# EAGLE design DancingLightBluetoothSpeakerTE_MP_Project (EAGLE 9.5.1)
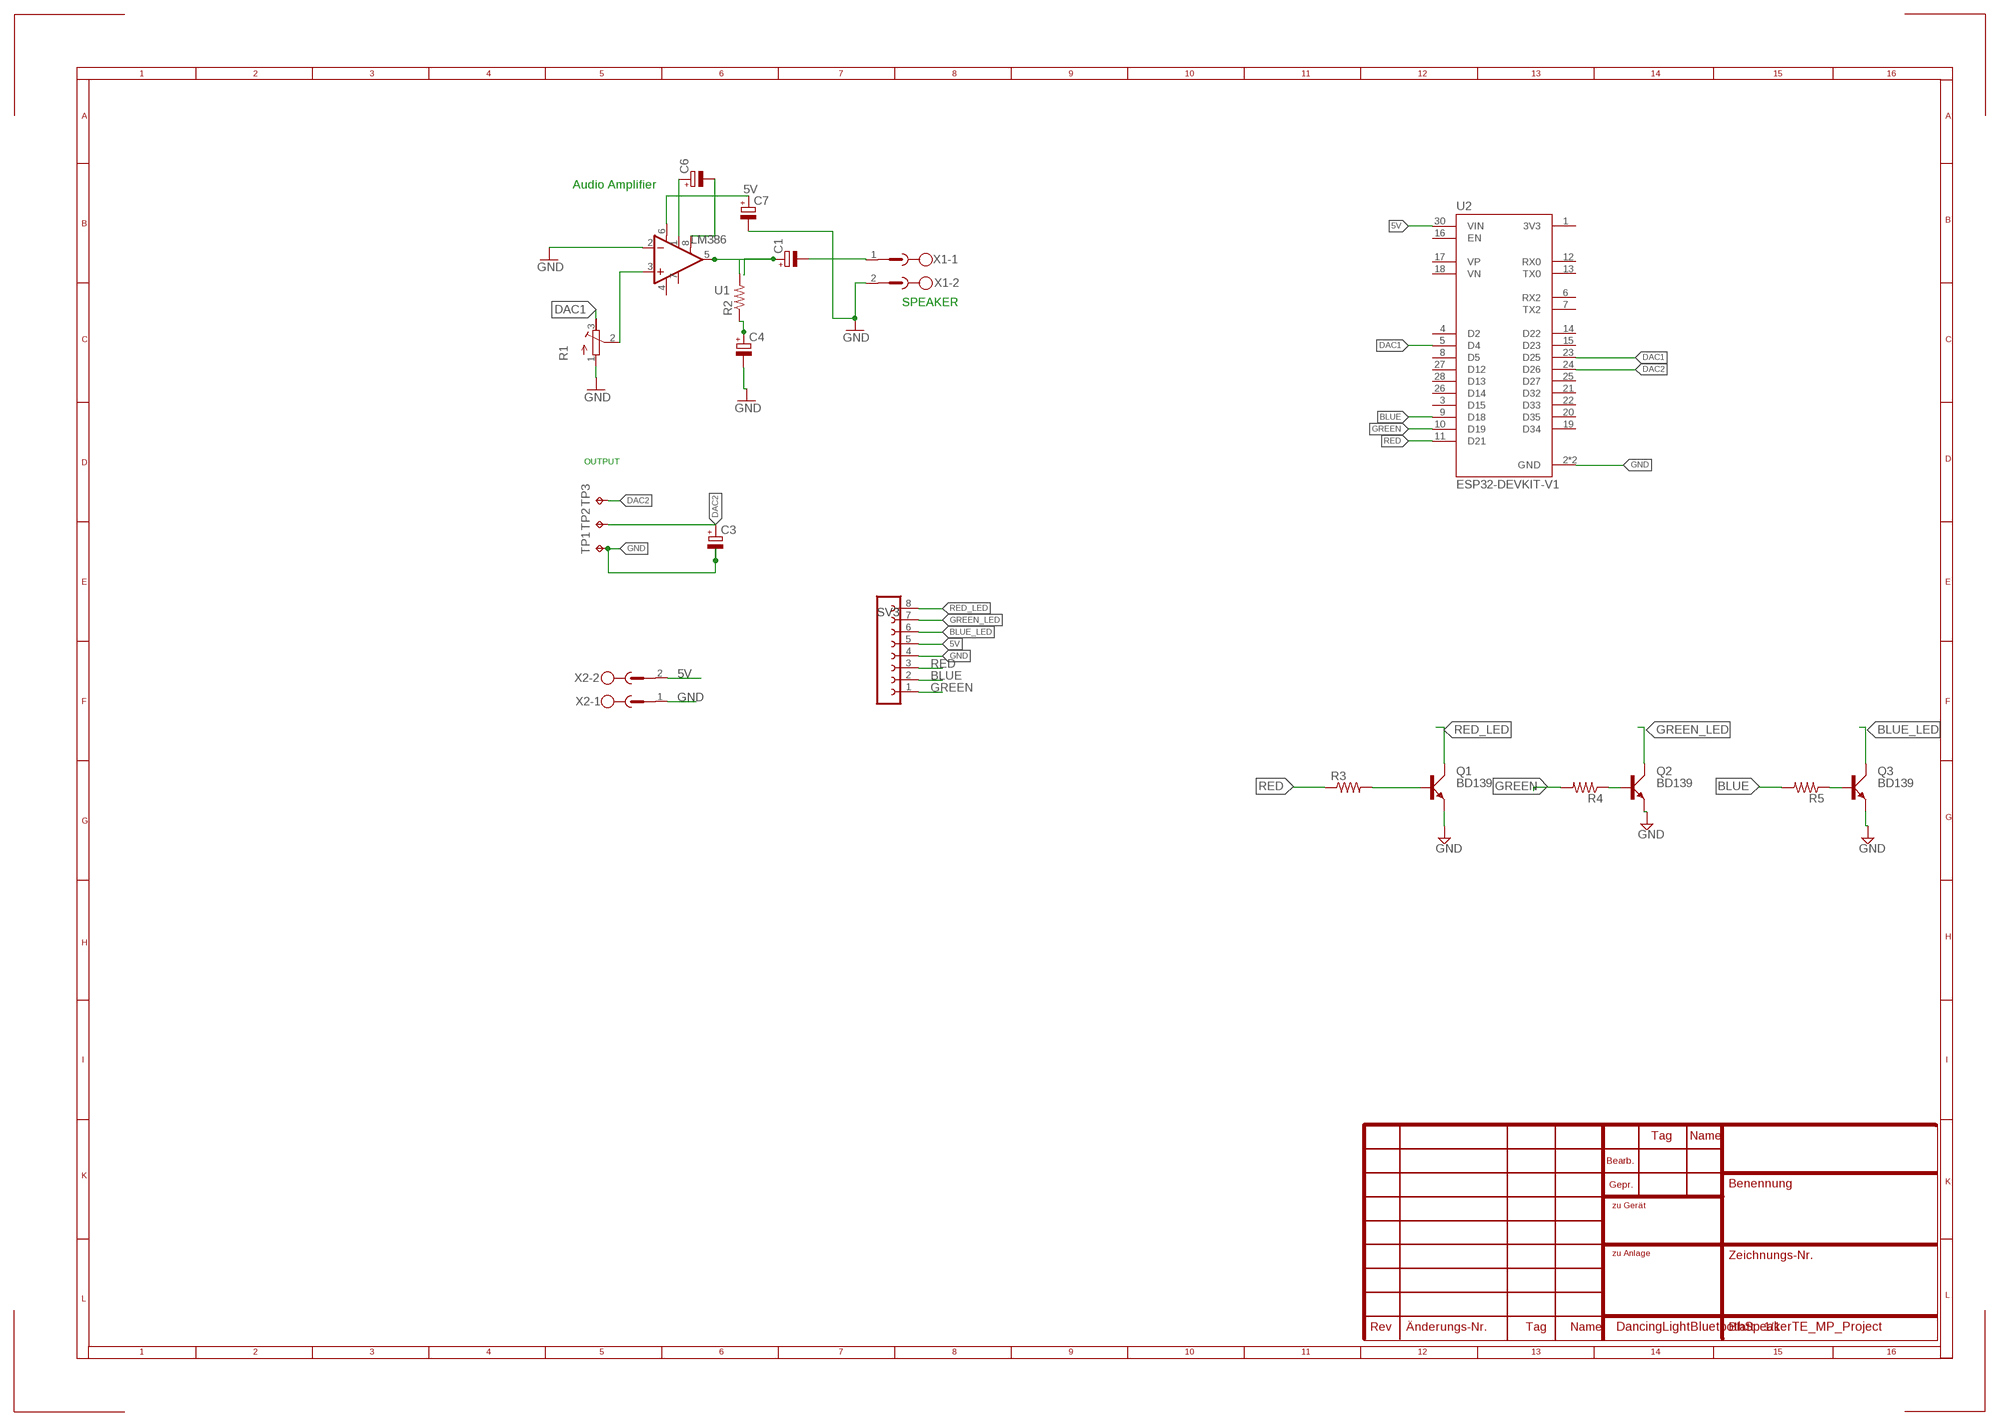
[diagram p0: schematic, sheet 1]

## Parts
C1  CPOL-EUE2-5  [E2-5]
C3  CPOL-EUE2-5  [E2-5]
C4  CPOL-EUE2-5  [E2-5]
C6  CPOL-EUE2-5  [E2-5]
C7  CPOL-EUE2-5  [E2-5]
Q1  BD139  [TO126AV]
Q2  BD139  [TO126AV]
Q3  BD139  [TO126AV]
R1  R-TRIMM3339P  [RTRIM3339P]
R2  R-US_0207/10  [0207/10]
R3  R-US_0207/10  [0207/10]
R4  R-US_0207/10  [0207/10]
R5  R-US_0207/10  [0207/10]
SV3  FE08-1  [FE08]
TP1  TPTP10SQ  [TP10SQ]
TP2  TPTP10SQ  [TP10SQ]
TP3  TPTP10SQ  [TP10SQ]
U1  LM386  [DIP08]
U2  ESP32-DEVKIT-V1  [MODULE_ESP32_DEVKIT_V1]
X1  MSTBV2  [MSTBV2]
X2  MSTBV2  [MSTBV2]

## Nets
5V: C7.+ SV3.5 U1.6(V+) U2.30(VIN) X2.2
BLUE: R5.2 SV3.2 U2.9(D18)
BLUE_LED: Q3.C SV3.6
DAC1: R1.3(E) U2.5(D4) U2.23(D25)
DAC2: C3.+ TP2.TP TP3.TP U2.24(D26)
GND: C3.- C4.- C7.- Q1.E Q2.E Q3.E R1.1(A) SV3.4 TP1.TP U1.2(-IN) U2.2(GND) U2.29(GND) X1.2 X2.1
GREEN: R4.2 SV3.1 U2.10(D19)
GREEN_LED: Q2.C SV3.7
N$1: C1.- X1.1
N$2: C4.+ R2.1
N$3: C1.+ R2.2 U1.5(OUT)
N$4: R1.2(S) U1.3(+IN)
N$5: Q1.B R3.2
N$6: Q2.B R4.1
N$7: Q3.B R5.1
N$9: C6.+ U1.1(GAIN)
N$10: C6.- U1.8(GAIN)
RED: R3.1 SV3.3 U2.11(D21)
RED_LED: Q1.C SV3.8
Unconnected: U1.7(BP) U2.1(3V3) U2.3(D15) U2.4(D2) U2.6(RX2) U2.7(TX2) U2.8(D5) U2.12(RX0) U2.13(TX0) U2.14(D22) U2.15(D23) U2.16(EN) U2.17(VP) U2.18(VN) U2.19(D34) U2.20(D35) U2.21(D32) U2.22(D33) U2.25(D27) U2.26(D14) U2.27(D12) U2.28(D13)

## Notes on the sheet
- Audio Amplifier
- SPEAKER
- OUTPUT

## Power pins joined to a net without a drawn wire
V-: U1.4(V-)

## Library data of the parts
C1 C3 C4 C6 C7 = rcl:CPOL-EU: POLARIZED CAPACITOR, European symbol; SPICEPREFIX: C
Q1-Q3 = transistor-power:BD139: NPN TRANSISTOR
R1 = rcl:R-TRIMM: Trimm resistor; SPICEMODEL: X; SPICEPREFIXL: POT
R2-R5 = adafruit:R-US_: RESISTOR, American symbol
SV3 = con-lsta:FE08-1: FEMALE HEADER; OC_FARNELL: unknown; OC_NEWARK: unknown
TP1-TP3 = testpad:TP: Test pad
U1 = LM386:LM386: low voltage audio power amplifier Check availability <https://pricing.snapeda.com/parts/LM386/Texas%20Instruments/view-part?ref=eda>; AVAILABILITY: In Stock; DESCRIPTION: Audio Amp Speaker 1-CH Mono 0.325W Class-AB 8-Pin VSSOP T/R; MF: Texas Instruments; MP: LM386; PACKAGE: DIP-8 Texas Instruments; PRICE: None; PURCHASE-URL: https://pricing.snapeda.com/search/part/LM386/?ref=eda
U2 = ESP32-DEVKIT-V1:ESP32-DEVKIT-V1: Dual core, Wi-Fi: 2.4 GHz up to 150 Mbits/s,BLE (Bluetooth Low Energy) and legacy Bluetooth, 32 bits, Up to 240 MHz Check availability <https://pricing.snapeda.com/parts/ESP32-DEVKIT-V1/Do%20it/view-part?ref=eda>; AVAILABILITY: Not in stock; DESCRIPTION: Dual core, Wi-Fi: 2.4 GHz up to 150 Mbits/s,BLE (Bluetooth Low Energy) and legacy Bluetooth, 32 bits, Up to 240 MHz; MF: Do it; MP: ESP32-DEVKIT-V1; PACKAGE: None; PRICE: None
X1 X2 = con-phoenix-500:MSTBV2: PHOENIX; OC_FARNELL: unknown; OC_NEWARK: unknown

## Board
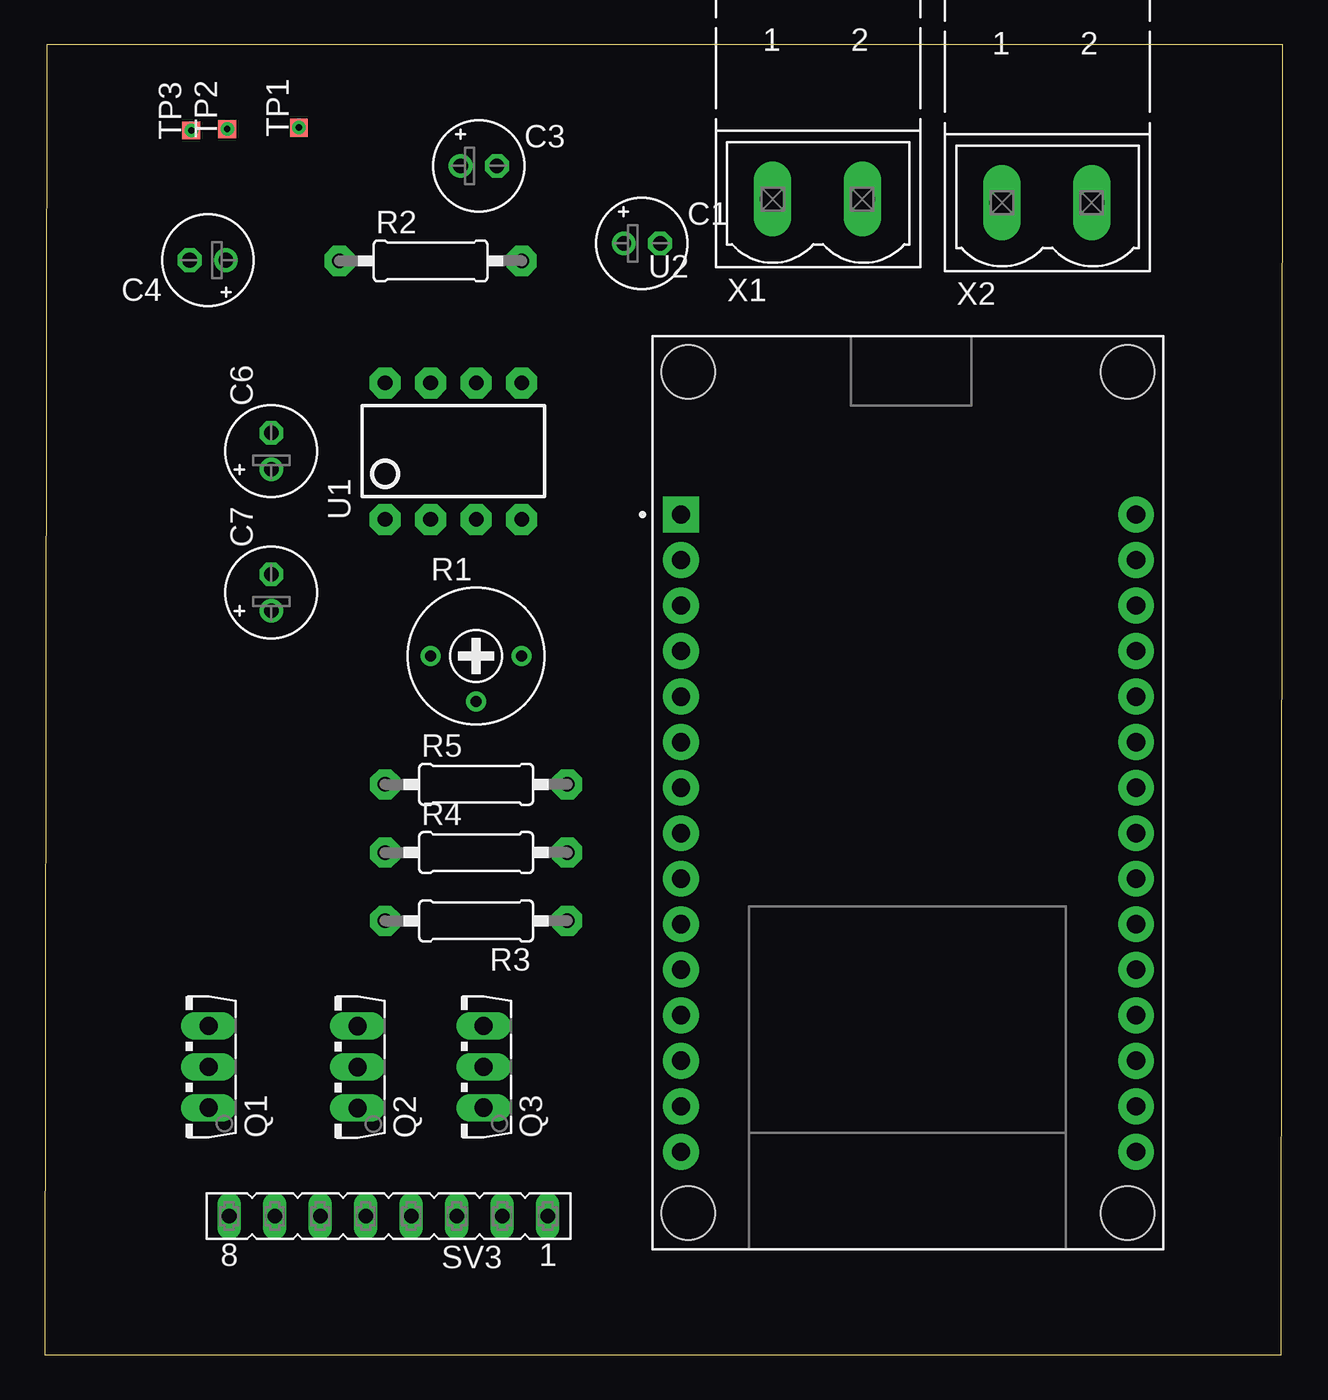
[diagram p1: board, top side]
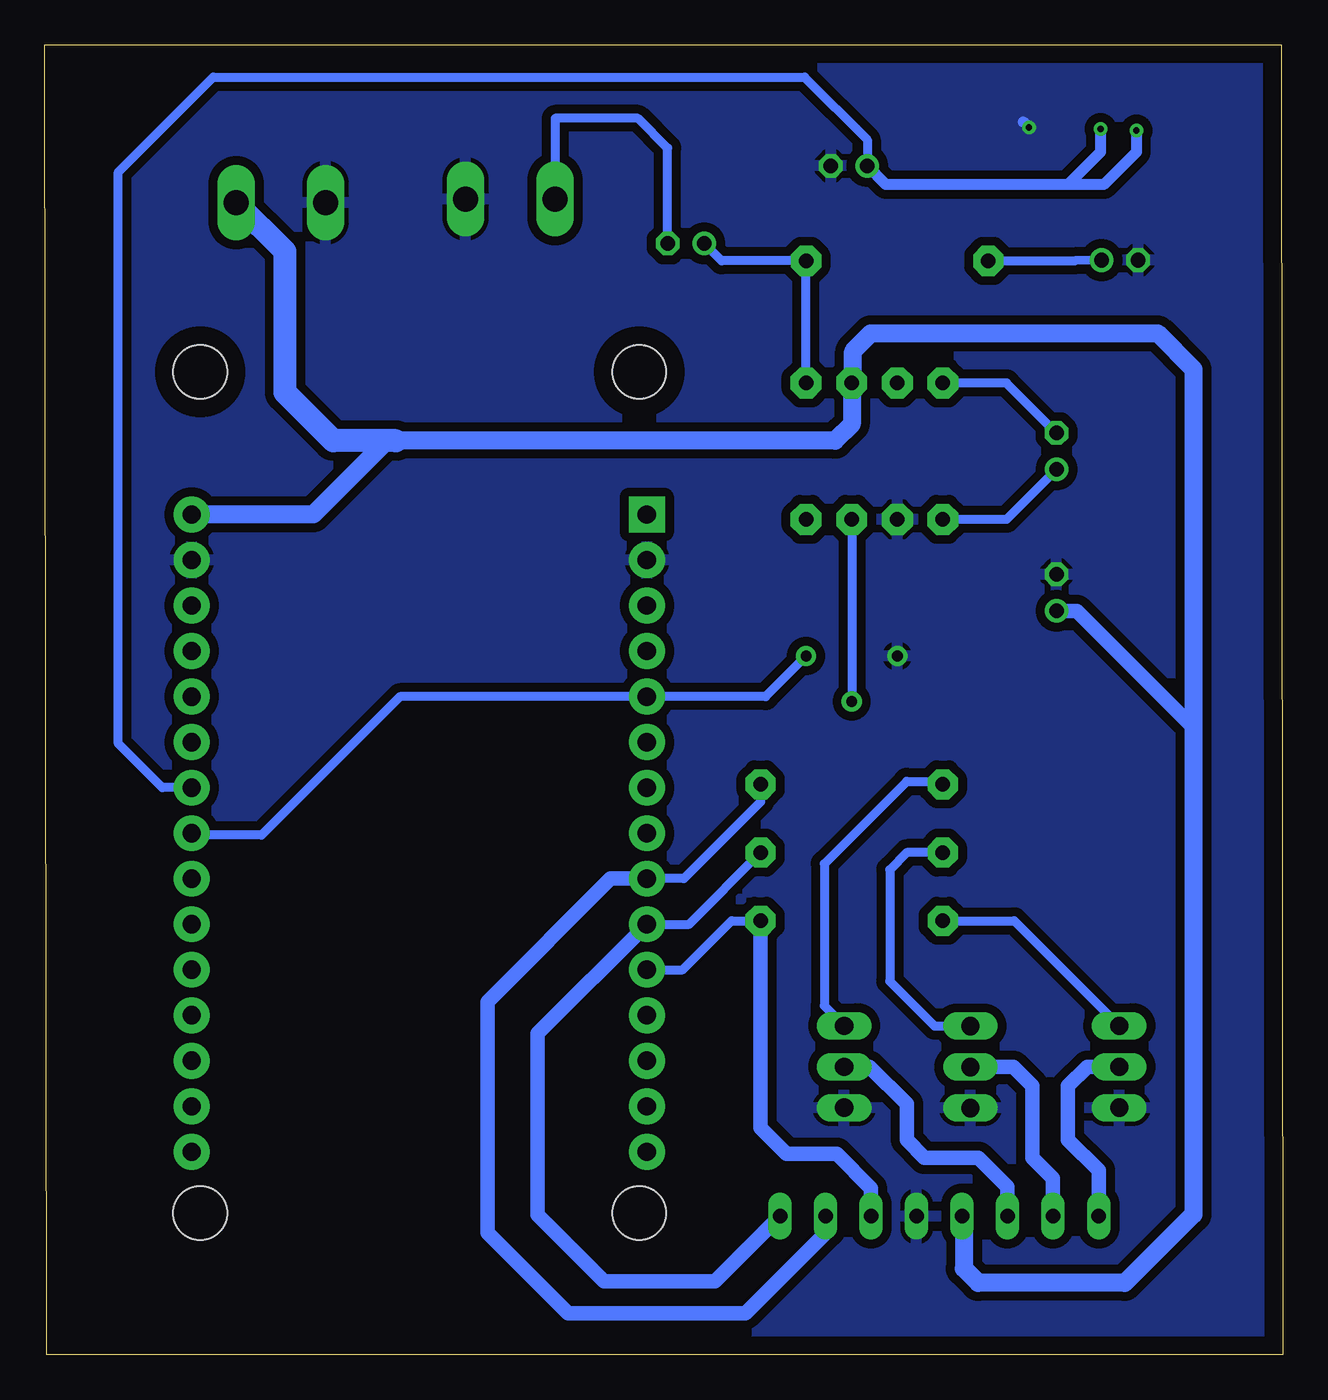
[diagram p2: board, bottom side, seen from below]

Size 69.1 x 73.1 mm. Coordinates in mm from the lower left corner, seen from the top.
Outline: 0,0 69,0 69.1,73.1 0.1,73.1 0,0
Copper layers (1*16): Top 0.035mm / dielectric 1.5mm / Bottom 0.035mm
Design rules "default": minimum track width 6mil, minimum drill 0.35mm, track to track 6mil, track to pad 6mil, pad to pad 6mil, via to via 6mil, smd to smd 6mil, copper to edge 40mil, drill to drill 6mil, minimum pad ring 10mil, minimum via ring 8mil, stop-mask expansion 4mil, vias tented up to drill 0mil, thermal gap 10mil

### Footprints (pad centres in the part's own frame; a part is rotated, then mirrored left to right if it is on the bottom)
E2-5 = drill 0.813 pad 1.27: + -1.016,0 | drill 0.813 pad 1.27 octagon: - 1.016,0
TO126AV = drill 1.016 long: B 2.286,-1.27; C 0,-1.27; E -2.286,-1.27
RTRIM3339P = drill 0.61: 1 -2.54,0; 2 0,-2.54; 3 2.54,0
0207/10 = drill 0.813 pad 1.676 octagon: 1 -5.08,0; 2 5.08,0
FE08 = drill 0.813 long: 1 -8.89,0; 2 -6.35,0; 3 -3.81,0; 4 -1.27,0; 5 1.27,0; 6 3.81,0; 7 6.35,0; 8 8.89,0
TP10SQ = smd 1 x 1: TP 0,0
DIP08 = drill 0.813 pad 1.727 octagon: 1 -3.81,-3.81; 2 -1.27,-3.81; 3 1.27,-3.81; 4 3.81,-3.81; 5 3.81,3.81; 6 1.27,3.81; 7 -1.27,3.81; 8 -3.81,3.81
MODULE_ESP32_DEVKIT_V1 = drill 1.02 pad 2 square: 1 -12.7,15.515 | drill 1.02 pad 2: 2 -12.7,12.975; 3 -12.7,10.435; 4 -12.7,7.895; 5 -12.7,5.355; 6 -12.7,2.815; 7 -12.7,0.275; 8 -12.7,-2.265; 9 -12.7,-4.805; 10 -12.7,-7.345; 11 -12.7,-9.885; 12 -12.7,-12.425; 13 -12.7,-14.965; 14 -12.7,-17.505; 15 -12.7,-20.045; 16 12.7,-20.045; 17 12.7,-17.505; 18 12.7,-14.965; 19 12.7,-12.425; 20 12.7,-9.885; 21 12.7,-7.345; 22 12.7,-4.805; 23 12.7,-2.265; 24 12.7,0.275; 25 12.7,2.815; 26 12.7,5.355; 27 12.7,7.895; 28 12.7,10.435; 29 12.7,12.975; 30 12.7,15.515 | hole 3: -12.28,-23.475; 12.23,-23.475; 12.23,23.475; -12.28,23.475
MSTBV2 = drill 1.397 long: 1 -2.5,0; 2 2.5,0

### Placement (x,y rotation side)
C1  33.32,62.02 0 top
C3  24.22,66.34 0 top
C4  9.1,61.08 180 top
C6  12.64,50.42 90 top
C7  12.64,42.53 90 top
Q1  7.87,16.07 90 top
Q2  16.18,16.05 90 top
Q3  23.22,16.07 90 top
R1  24.07,38.99 0 top
R2  21.53,61.04 0 top
R3  24.07,24.21 180 top
R4  24.07,28.02 0 top
R5  24.07,31.83 0 top
SV3  19.18,7.73 180 top
TP1  14.18,68.48 90 top
TP2  10.18,68.4 90 top
TP3  8.18,68.32 90 top
U1  22.8,50.42 0 top
U2  48.2,31.37 0 top
X1  43.12,64.49 0 top
X2  55.92,64.29 0 top

### Tracks (layer width: path | path; a pad name or v marks a point on that pad's centre or on a via)
5V
  Bottom 0.8: 5,35 11.51,41.51 C7.+
  Bottom 1: U2.30 54.11,46.88 50,51 49.5,51 25,51 24.07,51.93 U1.6 24,54.3 24,56 23,57 7,57 5,55 5,35 5,7.83 8.83,4 17,4 17.82,4.82 17.82,7.64 SV3.5
  Bottom 1.27: X2.2 55.7,61.57 55.7,53.7 53,51 49.5,51
BLUE
  Bottom 0.5: R5.2 29.15,30.85 33.44,26.56 U2.9
  Bottom 0.8: SV3.2 25.53,6.77 30,2.3 39.9,2.3 44.4,6.8 44.4,19.7 37.53,26.56 U2.9
BLUE_LED
  Bottom 0.8: Q3.C 23.07,16.07 21,14 21,12 20,11 17,11 15.37,9.37 SV3.6
DAC1
  Bottom 0.5: R1.3 28.88,36.73 U2.5 49.28,36.73 57,29 60.8,29 U2.23
DAC2  (via drill 0.35)
  Bottom 0.5: U2.24 62.55,31.65 65,34.1 65,66 59.7,71.3 26.7,71.3 23.2,67.8 C3.+
  Bottom 0.6: TP2.TP 10.18,67.12 12,65.3 | 12,65.3 22.16,65.3 C3.+ | TP3.TP 8.18,67.12 10,65.3 12,65.3
  other vias: 10.18,68.4 8.18,68.32
GND  (via drill 0.35)
  Bottom 0.6: 14.5,68.8 TP1.TP
  other vias: 14.18,68.48
  pour Bottom (isolate 0.5): 69.1,0 69.1,73.1 0.1,73.1 0,0 0.1,0
GREEN
  Bottom 0.5: U2.10 33.15,24.02 R4.2
  Bottom 0.8: U2.10 41.6,17.93 41.6,7.8 37.9,4.1 31.7,4.1 SV3.1
GREEN_LED
  Bottom 0.8: Q2.C 15.05,16.05 14,15 14,11 12.83,9.83 SV3.7
N$1
  Bottom 0.5: C1.- 34.34,67.34 36,69 40.62,69 X1.1
N$2
  Bottom 0.5: R2.1 11.62,61.04 C4.+
N$3
  Bottom 0.5: U1.5 R2.2 31.32,61.04 C1.+
N$4
  Bottom 0.5: U1.3 R1.2
N$5
  Bottom 0.5: R3.2 14.99,24.21 Q1.B
N$6
  Bottom 0.5: R4.1 20.99,28.02 21.95,27.06 21.95,20.84 19.45,18.34 Q2.B
N$7
  Bottom 0.5: R5.1 19.16,32 21,32 25.6,27.4 25.6,19.47 Q3.B
N$9
  Bottom 0.5: C6.+ 15.43,46.61 U1.1
N$10
  Bottom 0.5: C6.- 15.43,54.23 U1.8
RED
  Bottom 0.5: U2.11 33.5,21.48 30.77,24.21 R3.1
  Bottom 0.8: SV3.3 22.99,9.29 24.9,11.2 27.7,11.2 29.15,12.65 R3.1
RED_LED
  Bottom 0.8: Q1.C 10.93,16.07 12,15 12,12 10.29,10.29 SV3.8